# Altium schematic sheet 09.SchDoc
size 513 x 386 mm
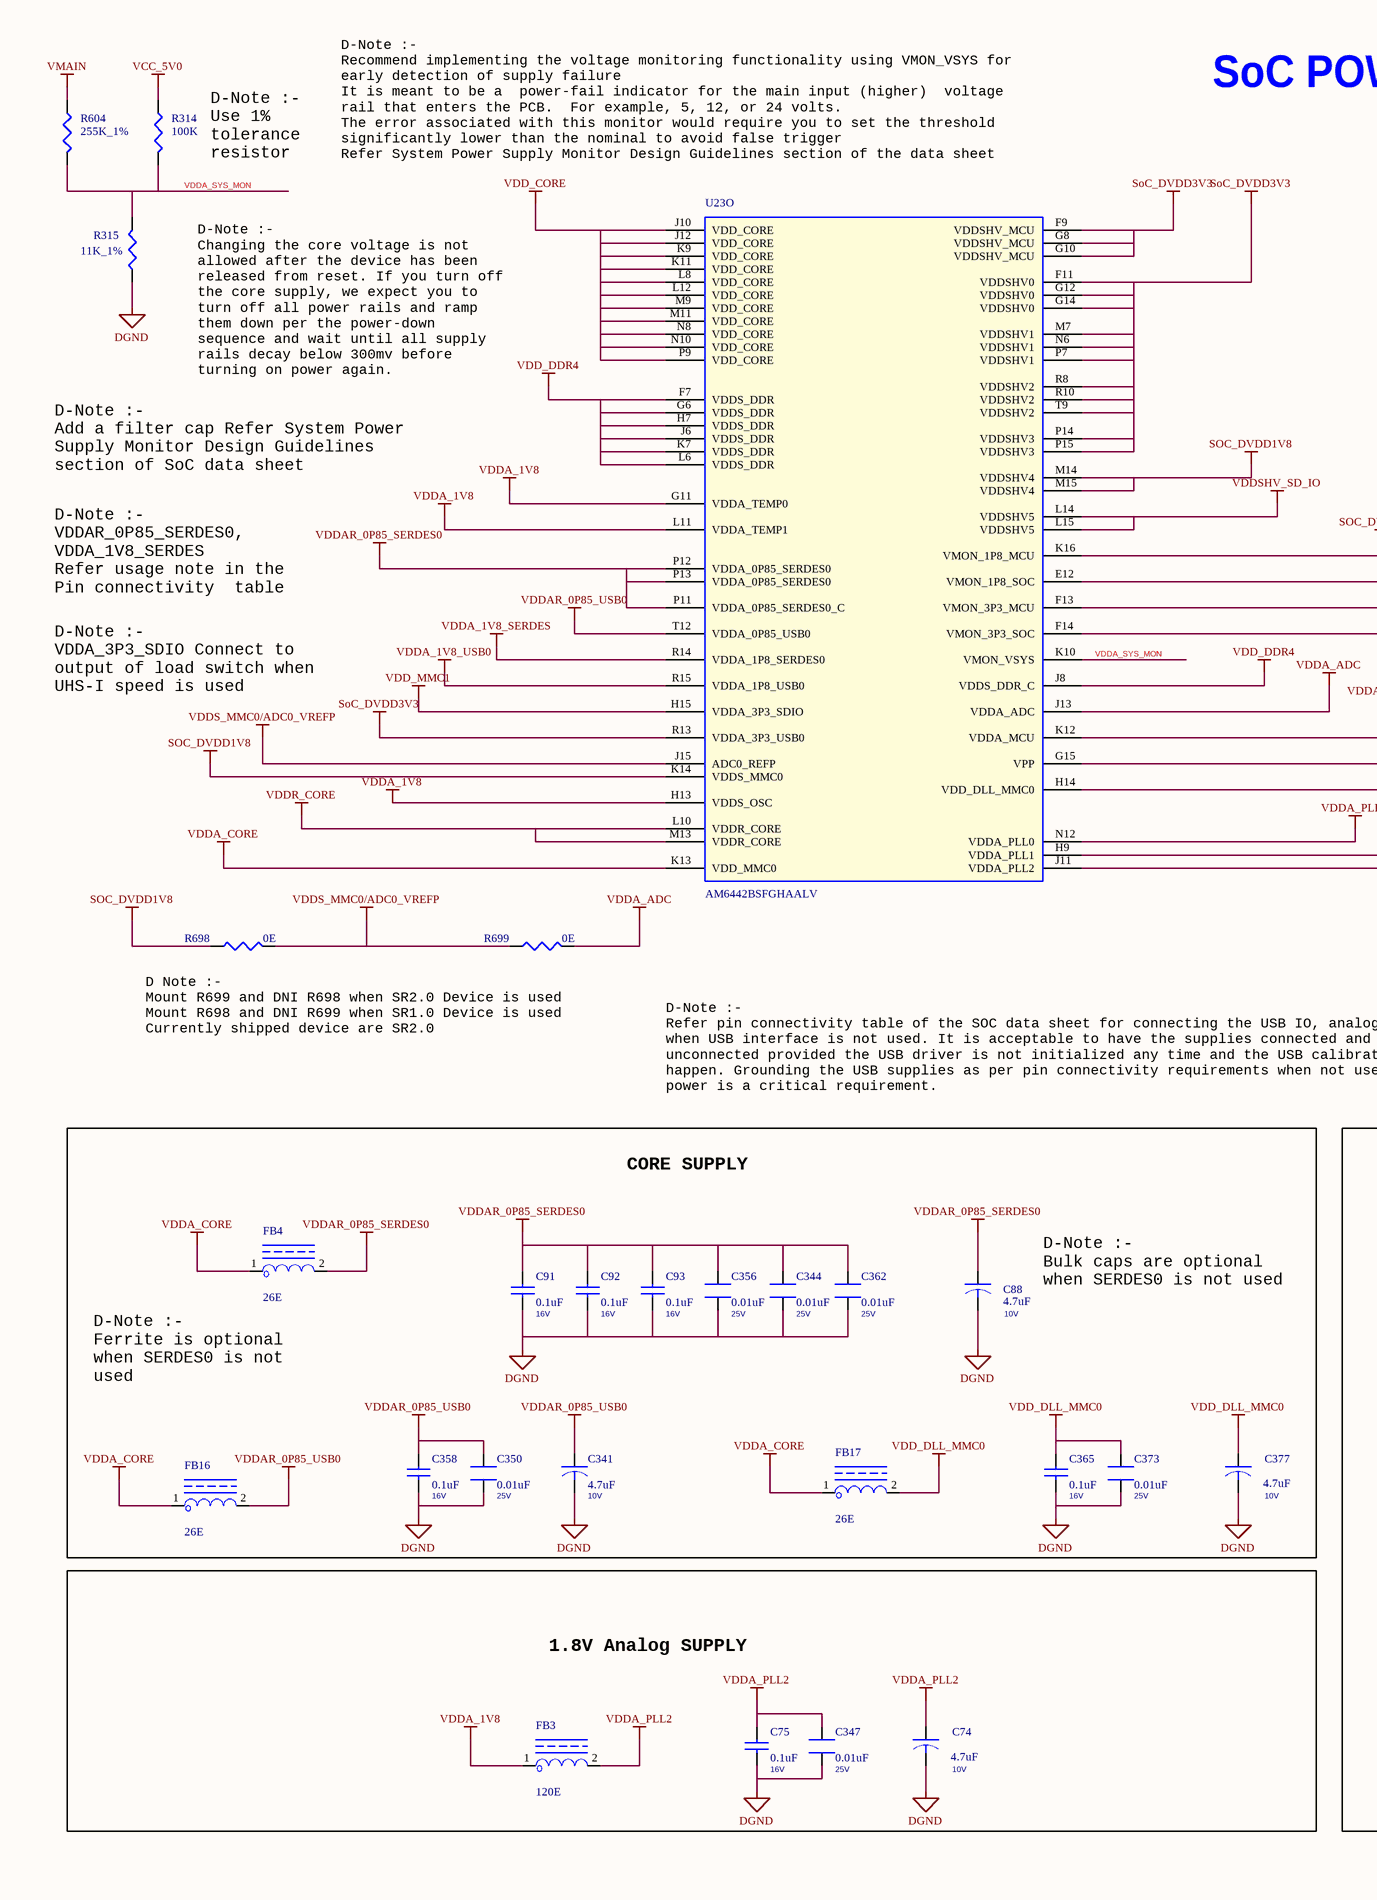
[diagram p0: 09.SchDoc, left]
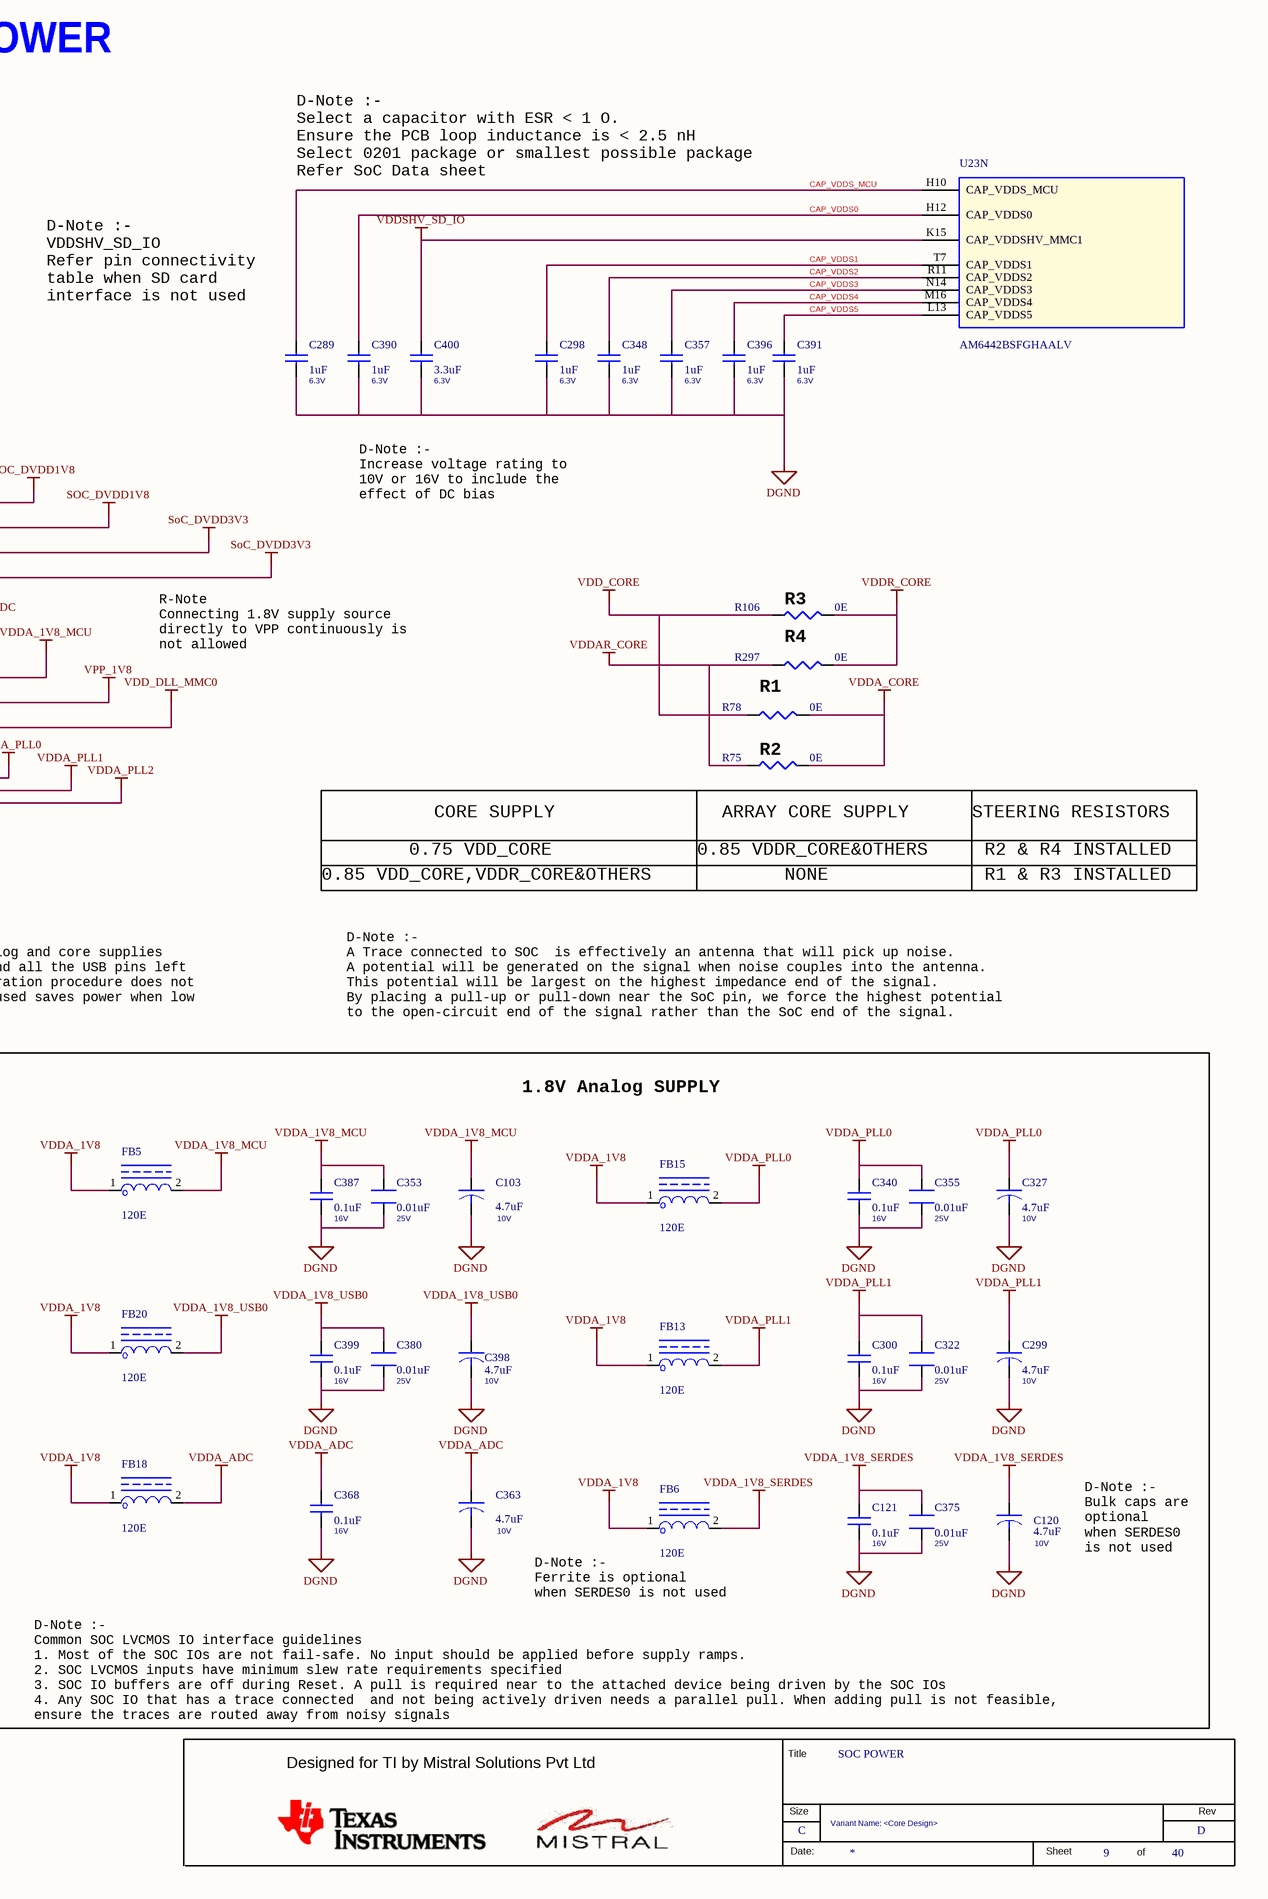
[diagram p1: 09.SchDoc, right]

## Parts
*  RevCode: D  Title: SOC POWER  Page Size: C  Page Number: 9  Page Count: 40  Variant Name: <Core Design>  (hidden comment: MISTRAL_TITLEBLK_CSIZE)  (graphical)
C74  4.7uF  Voltage: 10V  [CAP0402_0-75]
C75  0.1uF  Voltage: 16V  [CAP0201_0-5]
C88  4.7uF  Voltage: 10V  [CAP0402_0-75]
C91  0.1uF  Voltage: 16V  [CAP0201_0-5]
C92  0.1uF  Voltage: 16V  [CAP0201_0-5]
C93  0.1uF  Voltage: 16V  [CAP0201_0-5]
C103  4.7uF  Voltage: 10V  [CAP0402_0-75]
C120  4.7uF  Voltage: 10V  [CAP0402_0-75]
C121  0.1uF  Voltage: 16V  [CAP0201_0-5]
C289  1uF  Voltage: 6.3V  [CAP0201_0-5]
C298  1uF  Voltage: 6.3V  [CAP0201_0-5]
C299  4.7uF  Voltage: 10V  [CAP0402_0-75]
C300  0.1uF  Voltage: 16V  [CAP0201_0-5]
C322  0.01uF  Voltage: 25V  [CAP0402N]
C327  4.7uF  Voltage: 10V  [CAP0402_0-75]
C340  0.1uF  Voltage: 16V  [CAP0201_0-5]
C341  4.7uF  Voltage: 10V  [CAP0402_0-75]
C344  0.01uF  Voltage: 25V  [CAP0402N]
C347  0.01uF  Voltage: 25V  [CAP0402N]
C348  1uF  Voltage: 6.3V  [CAP0201_0-5]
C350  0.01uF  Voltage: 25V  [CAP0402N]
C353  0.01uF  Voltage: 25V  [CAP0402N]
C355  0.01uF  Voltage: 25V  [CAP0402N]
C356  0.01uF  Voltage: 25V  [CAP0402N]
C357  1uF  Voltage: 6.3V  [CAP0201_0-5]
C358  0.1uF  Voltage: 16V  [CAP0201_0-5]
C362  0.01uF  Voltage: 25V  [CAP0402N]
C363  4.7uF  Voltage: 10V  [CAP0402_0-75]
C365  0.1uF  Voltage: 16V  [CAP0201_0-5]
C368  0.1uF  Voltage: 16V  [CAP0201_0-5]
C373  0.01uF  Voltage: 25V  [CAP0402N]
C375  0.01uF  Voltage: 25V  [CAP0402N]
C377  4.7uF  Voltage: 10V  [CAP0402_0-75]
C380  0.01uF  Voltage: 25V  [CAP0402N]
C387  0.1uF  Voltage: 16V  [CAP0201_0-5]
C390  1uF  Voltage: 6.3V  [CAP0201_0-5]
C391  1uF  Voltage: 6.3V  [CAP0201_0-5]
C396  1uF  Voltage: 6.3V  [CAP0201_0-5]
C398  4.7uF  Voltage: 10V  [CAP0402_0-75]
C399  0.1uF  Voltage: 16V  [CAP0201_0-5]
C400  3.3uF  Voltage: 6.3V  [CAP0603_1]
FB3  120E  [IND0603_1]
FB4  26E  [IND0603_1]
FB5  120E  [IND0603_1]
FB6  120E  [IND0603_1]
FB13  120E  [IND0603_1]
FB15  120E  [IND0603_1]
FB16  26E  [IND0603_1]
FB17  26E  [IND0603_1]
FB18  120E  [IND0603_1]
FB20  120E  [IND0603_1]
R75  0E  [RES1210_0-75]
R78  0E  [RES1210_0-75]
R106  0E  [RES1210_0-75]
R297  0E  [RES1210_0-75]
R314  100K  [RES0402_0-5]
R315  11K_1%  [RES0402_0-5]
R604  255K_1%  [RES0402_0-5]
R698  0E  [RES0201_0-5]
R699  0E  [RES0201_0-5]
U23  AM6442BSFGHAALV  [FCBGA441_31-49_680X680_2-6]  (parts N,O of 16)

## Blocks framed on the sheet
CORE SUPPLY: C88 C91-C93 C341 C344 C350 C356 C358 C362 C365 C373 C377 FB4 FB16 FB17
1.8V Analog SUPPLY: C103 C120 C121 C299 C300 C322 C327 C340 C353 C355 C363 C368 C375 C380 C387 C398 C399 FB5 FB6 FB13 FB15 FB18 FB20
1.8V Analog SUPPLY: C74 C75 C347 FB3

## Nets
DGND: C74.2 C75.2 C88.2 C91.2 C92.2 C93.2 C103.2 C120.2 C121.2 C289.2 C298.2 C299.2 C300.2 C322.2 C327.2 C340.2 C341.2 C344.2 C347.2 C348.2 C350.2 C353.2 C355.2 C356.2 C357.2 C358.2 C362.2 C363.2 C365.2 C368.2 C373.2 C375.2 C377.2 C380.2 C387.2 C390.2 C391.2 C396.2 C398.2 C399.2 C400.2 R315.2
SOC_DVDD1V8: R698.1 U23.E12(VMON_1P8_SOC) U23.K14(VDDS_MMC0) U23.K16(VMON_1P8_MCU) U23.M14(VDDSHV4) U23.M15(VDDSHV4)
SoC_DVDD3V3: U23.F9(VDDSHV_MCU) U23.F11(VDDSHV0) U23.F13(VMON_3P3_MCU) U23.F14(VMON_3P3_SOC) U23.G8(VDDSHV_MCU) U23.G10(VDDSHV_MCU) U23.G12(VDDSHV0) U23.G14(VDDSHV0) U23.M7(VDDSHV1) U23.N6(VDDSHV1) U23.P7(VDDSHV1) U23.P14(VDDSHV3) U23.P15(VDDSHV3) U23.R8(VDDSHV2) U23.R10(VDDSHV2) U23.R13(VDDA_3P3_USB0) U23.T9(VDDSHV2)
VCC_5V0: R314.1
VDD_CORE: R78.1 R106.1 U23.J10(VDD_CORE) U23.J12(VDD_CORE) U23.K9(VDD_CORE) U23.K11(VDD_CORE) U23.L8(VDD_CORE) U23.L12(VDD_CORE) U23.M9(VDD_CORE) U23.M11(VDD_CORE) U23.N8(VDD_CORE) U23.N10(VDD_CORE) U23.P9(VDD_CORE)
VDD_DDR4: U23.F7(VDDS_DDR) U23.G6(VDDS_DDR) U23.H7(VDDS_DDR) U23.J6(VDDS_DDR) U23.J8(VDDS_DDR_C) U23.K7(VDDS_DDR) U23.L6(VDDS_DDR)
VDD_DLL_MMC0: C365.1 C373.1 C377.1 FB17.2 U23.H14(VDD_DLL_MMC0)
VDD_MMC1: U23.H15(VDDA_3P3_SDIO)
VDDA_1V8: FB3.1 FB5.1 FB6.1 FB13.1 FB15.1 FB18.1 FB20.1 U23.G11(VDDA_TEMP0) U23.H13(VDDS_OSC) U23.L11(VDDA_TEMP1)
VDDA_1V8_MCU: C103.1 C353.1 C387.1 FB5.2 U23.K12(VDDA_MCU)
VDDA_1V8_SERDES: C120.1 C121.1 C375.1 FB6.2 U23.R14(VDDA_1P8_SERDES0)
VDDA_1V8_USB0: C380.1 C398.1 C399.1 FB20.2 U23.R15(VDDA_1P8_USB0)
VDDA_ADC: C363.1 C368.1 FB18.2 R699.2 U23.J13(VDDA_ADC)
VDDA_CORE: FB4.1 FB16.1 FB17.1 R75.2 R78.2 U23.K13(VDD_MMC0)
VDDA_PLL0: C327.1 C340.1 C355.1 FB15.2 U23.N12(VDDA_PLL0)
VDDA_PLL1: C299.1 C300.1 C322.1 FB13.2 U23.H9(VDDA_PLL1)
VDDA_PLL2: C74.1 C75.1 C347.1 FB3.2 U23.J11(VDDA_PLL2)
VDDAR_0P85_SERDES0: C88.1 C91.1 C92.1 C93.1 C344.1 C356.1 C362.1 FB4.2 U23.P11(VDDA_0P85_SERDES0_C) U23.P12(VDDA_0P85_SERDES0) U23.P13(VDDA_0P85_SERDES0)
VDDAR_0P85_USB0: C341.1 C350.1 C358.1 FB16.2 U23.T12(VDDA_0P85_USB0)
VDDAR_CORE: R75.1 R297.1
VDDR_CORE: R106.2 R297.2 U23.L10(VDDR_CORE) U23.M13(VDDR_CORE)
VDDS_MMC0/ADC0_VREFP: R698.2 R699.1 U23.J15(ADC0_REFP)
VDDSHV_SD_IO: C400.1 U23.K15(CAP_VDDSHV_MMC1) U23.L14(VDDSHV5) U23.L15(VDDSHV5)
VMAIN: R604.1
VPP_1V8: U23.G15(VPP)
CAP_VDDS0: C390.1 U23.H12(CAP_VDDS0)
CAP_VDDS1: C298.1 U23.T7(CAP_VDDS1)
CAP_VDDS2: C348.1 U23.R11(CAP_VDDS2)
CAP_VDDS3: C357.1 U23.N14(CAP_VDDS3)
CAP_VDDS4: C396.1 U23.M16(CAP_VDDS4)
CAP_VDDS5: C391.1 U23.L13(CAP_VDDS5)
CAP_VDDS_MCU: C289.1 U23.H10(CAP_VDDS_MCU)
VDDA_SYS_MON: R314.2 R315.1 R604.2 U23.K10(VMON_VSYS)

## Notes on the sheet
- D-Note :-
  Recommend implementing the voltage monitoring functionality using VMON_VSYS for
  early detection of supply failure
  It is meant to be a  power-fail indicator for the main input (higher)  voltage
  rail that enters the PCB.  For example, 5, 12, or 24 volts.
  The error associated with this monitor would require you to set the threshold
  significantly lower than the nominal to avoid false trigger
  Refer System Power Supply Monitor Design Guidelines section of the data sheet
- D-Note :-
  Use 1%
  tolerance
  resistor
- SoC POWER
- D-Note :-
  Select a capacitor with ESR < 1 O.
  Ensure the PCB loop inductance is < 2.5 nH
  Select 0201 package or smallest possible package
  Refer SoC Data sheet
- D-Note :-
  Changing the core voltage is not
  allowed after the device has been
  released from reset. If you turn off
  the core supply, we expect you to
  turn off all power rails and ramp
  them down per the power-down
  sequence and wait until all supply
  rails decay below 300mv before
  turning on power again.
- D-Note :-
  VDDSHV_SD_IO
  Refer pin connectivity
  table when SD card
  interface is not used
- D-Note :-
  Add a filter cap Refer System Power
  Supply Monitor Design Guidelines
  section of SoC data sheet
- D-Note :-
  VDDAR_0P85_SERDES0,
  VDDA_1V8_SERDES
  Refer usage note in the
  Pin connectivity  table
- D-Note :-
  Increase voltage rating to
  10V or 16V to include the
  effect of DC bias
- D-Note :-
  VDDA_3P3_SDIO Connect to
  output of load switch when
  UHS-I speed is used
- R-Note
  Connecting 1.8V supply source
  directly to VPP continuously is
  not allowed
- (near R106) R3
- R4
- R1
- (near R75) R2
- CORE SUPPLY
- (near R75) ARRAY CORE SUPPLY
- STEERING RESISTORS
- D Note :-
  Mount R699 and DNI R698 when SR2.0 Device is used
  Mount R698 and DNI R699 when SR1.0 Device is used
  Currently shipped device are SR2.0
- 0.85 VDD_CORE,VDDR_CORE&OTHERS
- 0.75 VDD_CORE
- 0.85 VDDR_CORE&OTHERS
- NONE
- R2 & R4 INSTALLED
- R1 & R3 INSTALLED
- D-Note :-
  Refer pin connectivity table of the SOC data sheet for connecting the USB IO, analog and core supplies
  when USB interface is not used. It is acceptable to have the supplies connected and all the USB pins left
  unconnected provided the USB driver is not initialized any time and the USB calibration procedure does not
  happen. Grounding the USB supplies as per pin connectivity requirements when not used saves power when low
  power is a critical requirement.
- D-Note :-
  A Trace connected to SOC  is effectively an antenna that will pick up noise.
  A potential will be generated on the signal when noise couples into the antenna.
  This potential will be largest on the highest impedance end of the signal.
  By placing a pull-up or pull-down near the SoC pin, we force the highest potential
  to the open-circuit end of the signal rather than the SoC end of the signal.
- D-Note :-
  Bulk caps are optional
  when SERDES0 is not used
- (near FB4) D-Note :-
  Ferrite is optional
  when SERDES0 is not
  used
- D-Note :-
  Bulk caps are
  optional
  when SERDES0
  is not used
- (near FB6) D-Note :-
  Ferrite is optional
  when SERDES0 is not used
- (near *) D-Note :-
  Common SOC LVCMOS IO interface guidelines
  1. Most of the SOC IOs are not fail-safe. No input should be applied before supply ramps.
  2. SOC LVCMOS inputs have minimum slew rate requirements specified
  3. SOC IO buffers are off during Reset. A pull is required near to the attached device being driven by the SOC IOs
  4. Any SOC IO that has a trace connected  and not being actively driven needs a parallel pull. When adding pull is not feasible,
  ensure the traces are routed away from noisy signals
- (in symbol MISTRAL_TITLEBLK_CSIZE) Title; Designed for TI by Mistral Solutions Pvt Ltd; Size; Rev; Date:; Sheet; of

## Library data of the parts
* = MISTRAL_TITLEBLK_CSIZE: Issue: 1.0; Page Create Date: March  8, 1995; Page Modify Date: *
C74 C341 = CAP_Dup1: CAP CERAMIC 4.7uF 10V 20% X5R 0402; Mistral Part No: 120012060002-R; Mfr_name: AVX CORPORATION; Mfr_part_number: 0402ZD475MAT2A; Part_type: CAPACITORS\CERAMIC; Project: TI_MAXIE_CPB; Wattage: NA; Customs_HS_Code: 85322990; Custom_Duty: 15%; PCB Footprint: CAP0402_0-75; Footprint Ref: CAP0402_0-75; Tolerance: 20%; Package: 0402; Distributor_name: DIGIKEY; Distributor_part_number: 478-10791-1-ND; Library Ref: CAP; Height: 0.71MM; Weight: 0.65mg; Temperature: -55癈+85癈; Datasheet: Y:\MIS_DATABASE\DATASHEETS\CAPACITORS\AVX_MLC.PDF; Crtd /date: MANIRAJA/230118; Chkd/date: MANIRAJA/230118; MECHANICAL 3D STEP FILE: CAP0402_0-75; Library Path: Y:\MIS_DATABASE\Library\ALTIUM_TOOL\SCHEMATICS_PARTS\MS_DISCRETE_Library.schlib; Footprint Path: Y:\MIS_DATABASE\Library\ALTIUM_TOOL\PCB_FOOTPRINTS\Altium_Footprint_Lib.PcbLib
C75 C92 C93 C121 C358 C387 C399 = CAP_Dup3: CAP CERAMIC 0.1uF 16V 10% X5R 0201; Part_type: CAPACITORS\CERAMIC; Mfr_part_number: GRM033R61C104KE84J; Mfr_name: MURATA; Mistral Part No: 120009030072-R; Custom_Duty: 15%; Customs_HS_Code: 85322990; Wattage: NA; Project: TI_MAXIE_CPB; PCB Footprint: CAP0201_0-5; MECHANICAL 3D STEP FILE: CAP0201_0-5; Chkd/date: MANIRAJA/120218; Crtd /date: MANIRAJA/120218; Datasheet: Y:\MIS_DATABASE\DATASHEETS\CAPACITORS\GRM033R61C104KE84.PDF; Temperature: -55癈+85癈; Weight: 0.33mg; Height: 0.33MM; Distributor_part_number: 490-16742-1-ND; Distributor_name: DIGIKEY; Package: 0201; Tolerance: 10%; Library Ref: CAP; Footprint Ref: CAP0201_0-5; Library Path: Y:\MIS_DATABASE\Library\ALTIUM_TOOL\SCHEMATICS_PARTS\MS_DISCRETE_Library.schlib; Footprint Path: Y:\MIS_DATABASE\Library\ALTIUM_TOOL\PCB_FOOTPRINTS\Altium_Footprint_Lib.PcbLib
C88 C103 C120 C299 C327 C363 C377 C398 = CAP_Dup1: CAP CERAMIC 4.7uF 10V 20% X5R 0402; Part_type: CAPACITORS\CERAMIC; Mfr_part_number: 0402ZD475MAT2A; Mfr_name: AVX CORPORATION; Mistral Part No: 120012060002-R; Custom_Duty: 15%; Customs_HS_Code: 85322990; Wattage: NA; Project: TI_MAXIE_CPB; PCB Footprint: CAP0402_0-75; Footprint Path: Y:\MIS_DATABASE\Library\ALTIUM_TOOL\PCB_FOOTPRINTS\Altium_Footprint_Lib.PcbLib; Library Path: Y:\MIS_DATABASE\Library\ALTIUM_TOOL\SCHEMATICS_PARTS\MS_DISCRETE_Library.schlib; MECHANICAL 3D STEP FILE: CAP0402_0-75; Chkd/date: MANIRAJA/230118; Crtd /date: MANIRAJA/230118; Datasheet: Y:\MIS_DATABASE\DATASHEETS\CAPACITORS\AVX_MLC.PDF; Temperature: -55癈+85癈; Weight: 0.65mg; Height: 0.71MM; Library Ref: CAP; Distributor_part_number: 478-10791-1-ND; Distributor_name: DIGIKEY; Package: 0402; Tolerance: 20%; Footprint Ref: CAP0402_0-75
C91 C300 C340 C365 C368 = CAP_Dup3: CAP CERAMIC 0.1uF 16V 10% X5R 0201; Mistral Part No: 120009030072-R; Mfr_name: MURATA; Mfr_part_number: GRM033R61C104KE84J; Part_type: CAPACITORS\CERAMIC; Project: TI_MAXIE_CPB; Wattage: NA; Customs_HS_Code: 85322990; Custom_Duty: 15%; PCB Footprint: CAP0201_0-5; Library Ref: CAP; Tolerance: 10%; Package: 0201; Distributor_name: DIGIKEY; Distributor_part_number: 490-16742-1-ND; Height: 0.33MM; Weight: 0.33mg; Temperature: -55癈+85癈; Datasheet: Y:\MIS_DATABASE\DATASHEETS\CAPACITORS\GRM033R61C104KE84.PDF; Crtd /date: MANIRAJA/120218; Chkd/date: MANIRAJA/120218; MECHANICAL 3D STEP FILE: CAP0201_0-5; Footprint Ref: CAP0201_0-5; Library Path: Y:\MIS_DATABASE\Library\ALTIUM_TOOL\SCHEMATICS_PARTS\MS_DISCRETE_Library.schlib; Footprint Path: Y:\MIS_DATABASE\Library\ALTIUM_TOOL\PCB_FOOTPRINTS\Altium_Footprint_Lib.PcbLib
C289 C298 C357 C390 C396 = CAP_Dup3: CAP CERAMIC 1uF 6.3V 20% X5R 0201; Mistral Part No: 120012060001-R; Mfr_name: MURATA; Mfr_part_number: GRM033R60J105MEA2D; Part_type: CAPACITORS\CERAMIC; Project: MYTHIC_X16_BRD; Wattage: NA; Customs_HS_Code: 85322990; Custom_Duty: 15%; Footprint Ref: CAP0201_0-5; Tolerance: 20%; Package: 0201; Distributor_name: DIGIKEY; Distributor_part_number: 490-7229-1-ND; Library Ref: CAP; Height: 0.35MM; Weight: 7mg; Temperature: -55癈+85癈; Datasheet: Y:\MIS_DATABASE\DATASHEETS\CAPACITORS\GRM033R60J105MEA2.PDF; Crtd /date: ALVY/091219; Chkd/date: MANIRAJA/091219; MECHANICAL 3D STEP FILE: CAP0201_0-5; Library Path: Y:\MIS_DATABASE\Library\ALTIUM_TOOL\SCHEMATICS_PARTS\MS_DISCRETE_Library.schlib; Footprint Path: Y:\MIS_DATABASE\Library\ALTIUM_TOOL\PCB_FOOTPRINTS\Altium_Footprint_Lib.PcbLib; PCB Footprint: CAP0201_0-5
C322 C350 C353 C355 C356 C362 C375 C380 = CAP_Dup2: CAP CERAMIC 0.01uF 25V 10% X5R 0201; Mistral Part No: 120018010007-R; Mfr_name: MURATA; Mfr_part_number: GRM033R61E103KA12J; Part_type: CAPACITORS\CERAMIC; PCB Footprint: CAP0201_0-5; Project: TI_MAXIE_CPB; Customs_HS_Code: 85322990; Custom_Duty: 15%; Wattage: NA; Tolerance: 10%; Package: 0201; Distributor_name: DIGIKEY; Distributor_part_number: GRM033R61E103KA12J-ND; Height: 0.33MM; Datasheet: Y:\MIS_DATABASE\DATASHEETS\CAPACITORS\GRM033R61E103KA12.PDF; Crtd /date: MANIRAJA/230118; Chkd/date: MANIRAJA/230118; Weight: 0.33mg; Temperature: -55癈+85癈; MECHANICAL 3D STEP FILE: CAP0201_0-5; Library Ref: CAP; Footprint Ref: CAP0201_0-5; Library Path: Y:\MIS_DATABASE\Library\ALTIUM_TOOL\SCHEMATICS_PARTS\MS_DISCRETE_Library.schlib; Footprint Path: Y:\MIS_DATABASE\Library\ALTIUM_TOOL\PCB_FOOTPRINTS\Altium_Footprint_Lib.PcbLib
C344 C347 C373 = CAP_Dup2: CAP CERAMIC 0.01uF 25V 10% X5R 0201; Part_type: CAPACITORS\CERAMIC; Mfr_part_number: GRM033R61E103KA12J; Mfr_name: MURATA; Mistral Part No: 120018010007-R; PCB Footprint: CAP0201_0-5; Wattage: NA; Custom_Duty: 15%; Customs_HS_Code: 85322990; Project: TI_MAXIE_CPB; Library Ref: CAP; MECHANICAL 3D STEP FILE: CAP0201_0-5; Temperature: -55癈+85癈; Weight: 0.33mg; Chkd/date: MANIRAJA/230118; Crtd /date: MANIRAJA/230118; Datasheet: Y:\MIS_DATABASE\DATASHEETS\CAPACITORS\GRM033R61E103KA12.PDF; Height: 0.33MM; Distributor_part_number: GRM033R61E103KA12J-ND; Distributor_name: DIGIKEY; Package: 0201; Tolerance: 10%; Footprint Ref: CAP0201_0-5; Library Path: Y:\MIS_DATABASE\Library\ALTIUM_TOOL\SCHEMATICS_PARTS\MS_DISCRETE_Library.schlib; Footprint Path: Y:\MIS_DATABASE\Library\ALTIUM_TOOL\PCB_FOOTPRINTS\Altium_Footprint_Lib.PcbLib
C348 C391 = CAP_Dup3: CAP CERAMIC 1uF 6.3V 20% X5R 0201; Part_type: CAPACITORS\CERAMIC; Mfr_part_number: GRM033R60J105MEA2D; Mfr_name: MURATA; Mistral Part No: 120012060001-R; Custom_Duty: 15%; Customs_HS_Code: 85322990; Wattage: NA; Project: MYTHIC_X16_BRD; Footprint Path: Y:\MIS_DATABASE\Library\ALTIUM_TOOL\PCB_FOOTPRINTS\Altium_Footprint_Lib.PcbLib; Library Path: Y:\MIS_DATABASE\Library\ALTIUM_TOOL\SCHEMATICS_PARTS\MS_DISCRETE_Library.schlib; MECHANICAL 3D STEP FILE: CAP0201_0-5; Chkd/date: MANIRAJA/091219; Crtd /date: ALVY/091219; Datasheet: Y:\MIS_DATABASE\DATASHEETS\CAPACITORS\GRM033R60J105MEA2.PDF; Temperature: -55癈+85癈; Weight: 7mg; Height: 0.35MM; Library Ref: CAP; Distributor_part_number: 490-7229-1-ND; Distributor_name: DIGIKEY; Package: 0201; Tolerance: 20%; Footprint Ref: CAP0201_0-5; PCB Footprint: CAP0201_0-5
C400 = CAP_Dup3: CAP CERAMIC 3.3uF 6.3V 20% X5R AUTO 0603; Mistral Part No: 120021020026-R; Mfr_name: TDK; Mfr_part_number: CGA3E3X5R0J335M080AB; Part_type: CAPACITORS\CERAMIC; Project: TI_AM243x LP EVM; Wattage: NA; Customs_HS_Code: 85322990; Custom_Duty: 15%; Tolerance: 20%; Package: 0603; Distributor_name: DIGIKEY; Distributor_part_number: 445-12524-1-ND; Library Ref: CAP; Footprint Ref: CAP0603_1; Height: 0.90MM; Weight: 6.3mg; Temperature: -55癈+85癈; Datasheet: Y:\MIS_DATABASE\DATASHEETS\CAPACITORS\CGA3E3X5R0J335M080AB.PDF; Crtd /date: MANIRAJA/110221; Chkd/date: ALVY/110221; MECHANICAL 3D STEP FILE: CAP0603_1; Library Path: Y:\MIS_DATABASE\Library\ALTIUM_TOOL\SCHEMATICS_PARTS\MS_DISCRETE_Library.schlib; Footprint Path: Y:\MIS_DATABASE\Library\ALTIUM_TOOL\PCB_FOOTPRINTS\Altium_Footprint_Lib.PcbLib; PCB Footprint: CAP0603_1
FB3 FB5 FB18 FB20 = INDUCTOR_FERRITE: IND FERRITE BEAD CHIP 120E 2A 0603; Mfr_part_number: 782631141; Mfr_name: WURTH ELECTRONICS; Mistral Part No: 130020080015-R; Custom_Duty: 24%; Customs_HS_Code: 85437099; Wattage: NA; Tolerance: 25%; Project: AM64x_EVM_BRD; PCB Footprint: IND0603_1; Footprint Path: Y:\MIS_DATABASE\Library\ALTIUM_TOOL\PCB_FOOTPRINTS\Altium_Footprint_Lib.PcbLib; Library Path: Y:\MIS_DATABASE\Library\ALTIUM_TOOL\SCHEMATICS_PARTS\MS_FILTER_Library.schlib; MECHANICAL 3D STEP FILE: IND0603_1; Chkd/date: MANIRAJA/180820; Crtd /date: ALVY/180820; Datasheet: Y:\MIS_DATABASE\DATASHEETS\DISCRETES\INDUCTORS\782631141.PDF; Temperature: -55癈+125癈; Weight: NA; Height: 1.00MM; Library Ref: INDUCTOR_FERRITE; Distributor_part_number: 732-782631141CT-ND; Distributor_name: DIGIKEY; Package: 0603; Voltage: NA; Part_type: INDUCTOR; Footprint Ref: IND0603_1
FB4 = INDUCTOR_FERRITE: IND FERRITE BEAD CHIP 26E 6.5A 0603; Mistral Part No: 130020080017-R; Mfr_name: WURTH ELECTRONICS; Mfr_part_number: 74279228260; Project: AM64x_EVM_BRD; Tolerance: 25%; Voltage: NA; Customs_HS_Code: 85437099; Custom_Duty: 24%; PCB Footprint: IND0603_1; Footprint Ref: IND0603_1; Part_type: INDUCTOR; Wattage: NA; Package: 0603; Distributor_name: DIGIKEY; Distributor_part_number: 732-6117-1-ND; Library Ref: INDUCTOR_FERRITE; Height: 1.00MM; Weight: 2mg; Temperature: -55癈+125癈; Datasheet: Y:\MIS_DATABASE\DATASHEETS\DISCRETES\INDUCTORS\74279228260.PDF; Crtd /date: ALVY/180820; Chkd/date: MANIRAJA/180820; MECHANICAL 3D STEP FILE: IND0603_1; Library Path: Y:\MIS_DATABASE\Library\ALTIUM_TOOL\SCHEMATICS_PARTS\MS_FILTER_Library.schlib; Footprint Path: Y:\MIS_DATABASE\Library\ALTIUM_TOOL\PCB_FOOTPRINTS\Altium_Footprint_Lib.PcbLib
FB6 FB13 FB15 = INDUCTOR_FERRITE: IND FERRITE BEAD CHIP 120E 2A 0603; Mistral Part No: 130020080015-R; Mfr_name: WURTH ELECTRONICS; Mfr_part_number: 782631141; Project: AM64x_EVM_BRD; Tolerance: 25%; Voltage: NA; Customs_HS_Code: 85437099; Custom_Duty: 24%; PCB Footprint: IND0603_1; Footprint Ref: IND0603_1; Part_type: INDUCTOR; Wattage: NA; Package: 0603; Distributor_name: DIGIKEY; Distributor_part_number: 732-782631141CT-ND; Library Ref: INDUCTOR_FERRITE; Height: 1.00MM; Weight: NA; Temperature: -55癈+125癈; Datasheet: Y:\MIS_DATABASE\DATASHEETS\DISCRETES\INDUCTORS\782631141.PDF; Crtd /date: ALVY/180820; Chkd/date: MANIRAJA/180820; MECHANICAL 3D STEP FILE: IND0603_1; Library Path: Y:\MIS_DATABASE\Library\ALTIUM_TOOL\SCHEMATICS_PARTS\MS_FILTER_Library.schlib; Footprint Path: Y:\MIS_DATABASE\Library\ALTIUM_TOOL\PCB_FOOTPRINTS\Altium_Footprint_Lib.PcbLib
FB16 FB17 = INDUCTOR_FERRITE: IND FERRITE BEAD CHIP 26E 6.5A 0603; Mfr_part_number: 74279228260; Mfr_name: WURTH ELECTRONICS; Mistral Part No: 130020080017-R; Custom_Duty: 24%; Customs_HS_Code: 85437099; Wattage: NA; Tolerance: 25%; Project: AM64x_EVM_BRD; PCB Footprint: IND0603_1; Footprint Path: Y:\MIS_DATABASE\Library\ALTIUM_TOOL\PCB_FOOTPRINTS\Altium_Footprint_Lib.PcbLib; Library Path: Y:\MIS_DATABASE\Library\ALTIUM_TOOL\SCHEMATICS_PARTS\MS_FILTER_Library.schlib; MECHANICAL 3D STEP FILE: IND0603_1; Chkd/date: MANIRAJA/180820; Crtd /date: ALVY/180820; Datasheet: Y:\MIS_DATABASE\DATASHEETS\DISCRETES\INDUCTORS\74279228260.PDF; Temperature: -55癈+125癈; Weight: 2mg; Height: 1.00MM; Library Ref: INDUCTOR_FERRITE; Distributor_part_number: 732-6117-1-ND; Distributor_name: DIGIKEY; Package: 0603; Voltage: NA; Part_type: INDUCTOR; Footprint Ref: IND0603_1
R75 = RESISTOR: RES 0E 1/2W 5% 1210; Mistral Part No: 110009030080-R; Mfr_name: YAGEO AMERICA; Mfr_part_number: RC1210JR-070RL; Part_type: RESISTORS\FIXED; Project: OMAP_EVM; Voltage: NA; Customs_HS_Code: 85332119; Custom_Duty: 15%; PCB Footprint: RES1210_0-75; Footprint Ref: RES1210_0-75; Tolerance: 5%; Wattage: 1/2W; Package: 1210; Distributor_name: MOUSER; Distributor_part_number: 603-RC1210JR-070RL; Library Ref: RESISTOR; Height: 0.65MM; Weight: 10mg; Temperature: -55癈+155癈; Datasheet: Y:\MIS_DATABASE\DATASHEETS\RESISTORS\RCXXXXL-SER_MAR18.PDF; Crtd /date: USMAN/080109; Chkd/date: VASANTHA/281216; MECHANICAL 3D STEP FILE: RES1210_0-75; Library Path: Y:\MIS_DATABASE\Library\ALTIUM_TOOL\SCHEMATICS_PARTS\MS_DISCRETE_Library.schlib; Footprint Path: Y:\MIS_DATABASE\Library\ALTIUM_TOOL\PCB_FOOTPRINTS\Altium_Footprint_Lib.PcbLib
R78 R106 R297 = RESISTOR: RES 0E 1/2W 5% 1210; Part_type: RESISTORS\FIXED; Mfr_part_number: RC1210JR-070RL; Mfr_name: YAGEO AMERICA; Mistral Part No: 110009030080-R; Custom_Duty: 15%; Customs_HS_Code: 85332119; Voltage: NA; Project: OMAP_EVM; PCB Footprint: RES1210_0-75; Footprint Path: Y:\MIS_DATABASE\Library\ALTIUM_TOOL\PCB_FOOTPRINTS\Altium_Footprint_Lib.PcbLib; Library Path: Y:\MIS_DATABASE\Library\ALTIUM_TOOL\SCHEMATICS_PARTS\MS_DISCRETE_Library.schlib; MECHANICAL 3D STEP FILE: RES1210_0-75; Chkd/date: VASANTHA/281216; Crtd /date: USMAN/080109; Datasheet: Y:\MIS_DATABASE\DATASHEETS\RESISTORS\RCXXXXL-SER_MAR18.PDF; Temperature: -55癈+155癈; Weight: 10mg; Height: 0.65MM; Library Ref: RESISTOR; Distributor_part_number: 603-RC1210JR-070RL; Distributor_name: MOUSER; Package: 1210; Wattage: 1/2W; Tolerance: 5%; Footprint Ref: RES1210_0-75
R314 = RESISTOR_Dup5: RES 100K 1/16W 5% 0402; Part_type: RESISTORS\FIXED; Mfr_part_number: CRCW0402100KJNED; Mfr_name: VISHAY; Mistral Part No: 110011060002-R; Custom_Duty: 15%; Customs_HS_Code: 85332119; Voltage: NA; Project: AM4515_EVM_LCD; PCB Footprint: RES0402_0-5; Chkd/date: VASANTHA/061216; Crtd /date: BAVISH/010611; Datasheet: Y:\MIS_DATABASE\DATASHEETS\RESISTORS\CRCW0603.PDF; Temperature: -55癈+155癈; Weight: 0.65mg; Height: 0.40MM; Distributor_part_number: 541-100KJCT-ND; Distributor_name: DIGIKEY; Package: 0402; Wattage: 1/16W; Tolerance: 5%; MECHANICAL 3D STEP FILE: RES0402_0-5; Library Ref: RESISTOR; Footprint Ref: RES0402_0-5; Library Path: Y:\MIS_DATABASE\Library\ALTIUM_TOOL\SCHEMATICS_PARTS\MS_DISCRETE_Library.schlib; Footprint Path: Y:\MIS_DATABASE\Library\ALTIUM_TOOL\PCB_FOOTPRINTS\Altium_Footprint_Lib.PcbLib
R315 = RESISTOR_Dup6: RES 11K 1/16W 1% 0402; Mistral Part No: 110015110012-R; Mfr_name: YAGEO AMERICA; Mfr_part_number: RC0402FR-0711KL; Part_type: RESISTORS\FIXED; Project: TI_VLAN_SWITCH; Voltage: NA; Customs_HS_Code: 85332119; Custom_Duty: 15%; PCB Footprint: RES0402_0-5; Library Ref: RESISTOR; Tolerance: 1%; Wattage: 1/16W; Package: 0402; Distributor_name: DIGIKEY; Distributor_part_number: 311-11.0KLRCT-ND; Height: 0.40MM; Weight: 0.65mg; Temperature: -55癈+155癈; Datasheet: Y:\MIS_DATABASE\DATASHEETS\RESISTORS\RCXXXXL-SER_MAR18.PDF; Crtd /date: VASANTHA/251115; Chkd/date: VASANTHA/251115; MECHANICAL 3D STEP FILE: RES0402_0-5; Footprint Ref: RES0402_0-5; Library Path: Y:\MIS_DATABASE\Library\ALTIUM_TOOL\SCHEMATICS_PARTS\MS_DISCRETE_Library.schlib; Footprint Path: Y:\MIS_DATABASE\Library\ALTIUM_TOOL\PCB_FOOTPRINTS\Altium_Footprint_Lib.PcbLib
R604 = RESISTOR_Dup6: RES 255K 1/10W 1% 0402; Part_type: RESISTORS\FIXED; Mfr_part_number: ERJ-2RKF2553X; Mfr_name: PANASONIC-ECG; Mistral Part No: 110018020016-R; Custom_Duty: 15%; Customs_HS_Code: 85332119; Voltage: NA; Project: NPOL_SAR_ADC; PCB Footprint: RES0402_0-5; Footprint Path: Y:\MIS_DATABASE\Library\ALTIUM_TOOL\PCB_FOOTPRINTS\Altium_Footprint_Lib.PcbLib; Library Path: Y:\MIS_DATABASE\Library\ALTIUM_TOOL\SCHEMATICS_PARTS\MS_DISCRETE_Library.schlib; MECHANICAL 3D STEP FILE: RES0402_0-5; Chkd/date: MANIRAJA/160218; Crtd /date: MANIRAJA/160218; Datasheet: Y:\MIS_DATABASE\DATASHEETS\RESISTORS\PAN-ERJSER_NOV17.PDF; Temperature: -55癈+155癈; Weight: 0.8mg; Height: 0.40MM; Library Ref: RESISTOR; Distributor_part_number: P255KLCT-ND; Distributor_name: DIGIKEY; Package: 0402; Wattage: 1/10W; Tolerance: 1%; Footprint Ref: RES0402_0-5
R698 = RESISTOR_Dup5: RES 0E 1/20W 5% 0201; Mistral Part No: 110010070067-R; Mfr_name: YAGEO AMERICA; Mfr_part_number: RC0201JR-070RL; Part_type: RESISTORS\FIXED; Project: PB_BUGBASE; Voltage: NA; Customs_HS_Code: 85332119; Custom_Duty: 15%; PCB Footprint: RES0201_0-5; Footprint Path: Y:\MIS_DATABASE\Library\ALTIUM_TOOL\PCB_FOOTPRINTS\Altium_Footprint_Lib.PcbLib; Library Path: Y:\MIS_DATABASE\Library\ALTIUM_TOOL\SCHEMATICS_PARTS\MS_DISCRETE_Library.schlib; Footprint Ref: RES0201_0-5; Library Ref: RESISTOR; Tolerance: 5%; Wattage: 1/20W; Package: 0201; Distributor_name: DIGIKEY; Distributor_part_number: 311-0.0NCT-ND; Height: 0.26MM; Weight: 0.17mg; Temperature: -55癈+125癈; Datasheet: Y:\MIS_DATABASE\DATASHEETS\RESISTORS\RCXXXXL-SER_MAR18.PDF; Crtd /date: MUDDU/120710; Chkd/date: NAVEED/301214; MECHANICAL 3D STEP FILE: RES0201_0-5
R699 = RESISTOR_Dup5: RES 0E 1/20W 5% 0201; Part_type: RESISTORS\FIXED; Mfr_part_number: RC0201JR-070RL; Mfr_name: YAGEO AMERICA; Mistral Part No: 110010070067-R; Custom_Duty: 15%; Customs_HS_Code: 85332119; Voltage: NA; Project: PB_BUGBASE; PCB Footprint: RES0201_0-5; MECHANICAL 3D STEP FILE: RES0201_0-5; Chkd/date: NAVEED/301214; Crtd /date: MUDDU/120710; Datasheet: Y:\MIS_DATABASE\DATASHEETS\RESISTORS\RCXXXXL-SER_MAR18.PDF; Temperature: -55癈+125癈; Weight: 0.17mg; Height: 0.26MM; Distributor_part_number: 311-0.0NCT-ND; Distributor_name: DIGIKEY; Package: 0201; Wattage: 1/20W; Tolerance: 5%; Library Ref: RESISTOR; Footprint Ref: RES0201_0-5; Library Path: Y:\MIS_DATABASE\Library\ALTIUM_TOOL\SCHEMATICS_PARTS\MS_DISCRETE_Library.schlib; Footprint Path: Y:\MIS_DATABASE\Library\ALTIUM_TOOL\PCB_FOOTPRINTS\Altium_Footprint_Lib.PcbLib
U23 = XAM6442BSFGGAALV_BGA441: IC AM64x SoC MICROPROCESSOR BGA441; Mistral Part No: 141220080002; Mfr_name: TEXAS INSTRUMENTS; Part_type: ICS\DIGITAL\MICROPROCESSOR; Project: AM64x-GP_EVM BRD; Tolerance: NA; Customs_HS_Code: 85423100; Custom_Duty: 15%; Footprint Ref: FCBGA441_31-49_680X680_2-6; Mfr_part_number: AM6442BSFGHAALV; Voltage: NA; Wattage: NA; Package: BGA441; Distributor_name: NA; Distributor_part_number: NA; Library Ref: XAM6442BSFGGAALV_BGA441; Height: 2.57MM; Weight: NA; Temperature: NA; Datasheet: Y:\MIS_DATABASE\DATASHEETS\ICS\DIGITAL\MICROCONTROLLER\AM64-SoC_SVB.PDF; Crtd /date: ALVY/300322; Chkd/date: ALVY/300322; RoHS: NA; MECHANICAL 3D STEP FILE: FCBGA441_31-49_680X680_2-6; Library Path: Y:\MIS_DATABASE\Library\ALTIUM_TOOL\SCHEMATICS_PARTS\MS_MICROPROCESSOR_Library.schlib; Footprint Path: Y:\MIS_DATABASE\Library\ALTIUM_TOOL\PCB_FOOTPRINTS\Altium_Footprint_Lib.PcbLib; PCB Footprint: FCBGA441_31-49_680X680_2-6